# EAGLE schematic 50_Shot_Relay_V0.0 (EAGLE 7.6.0)
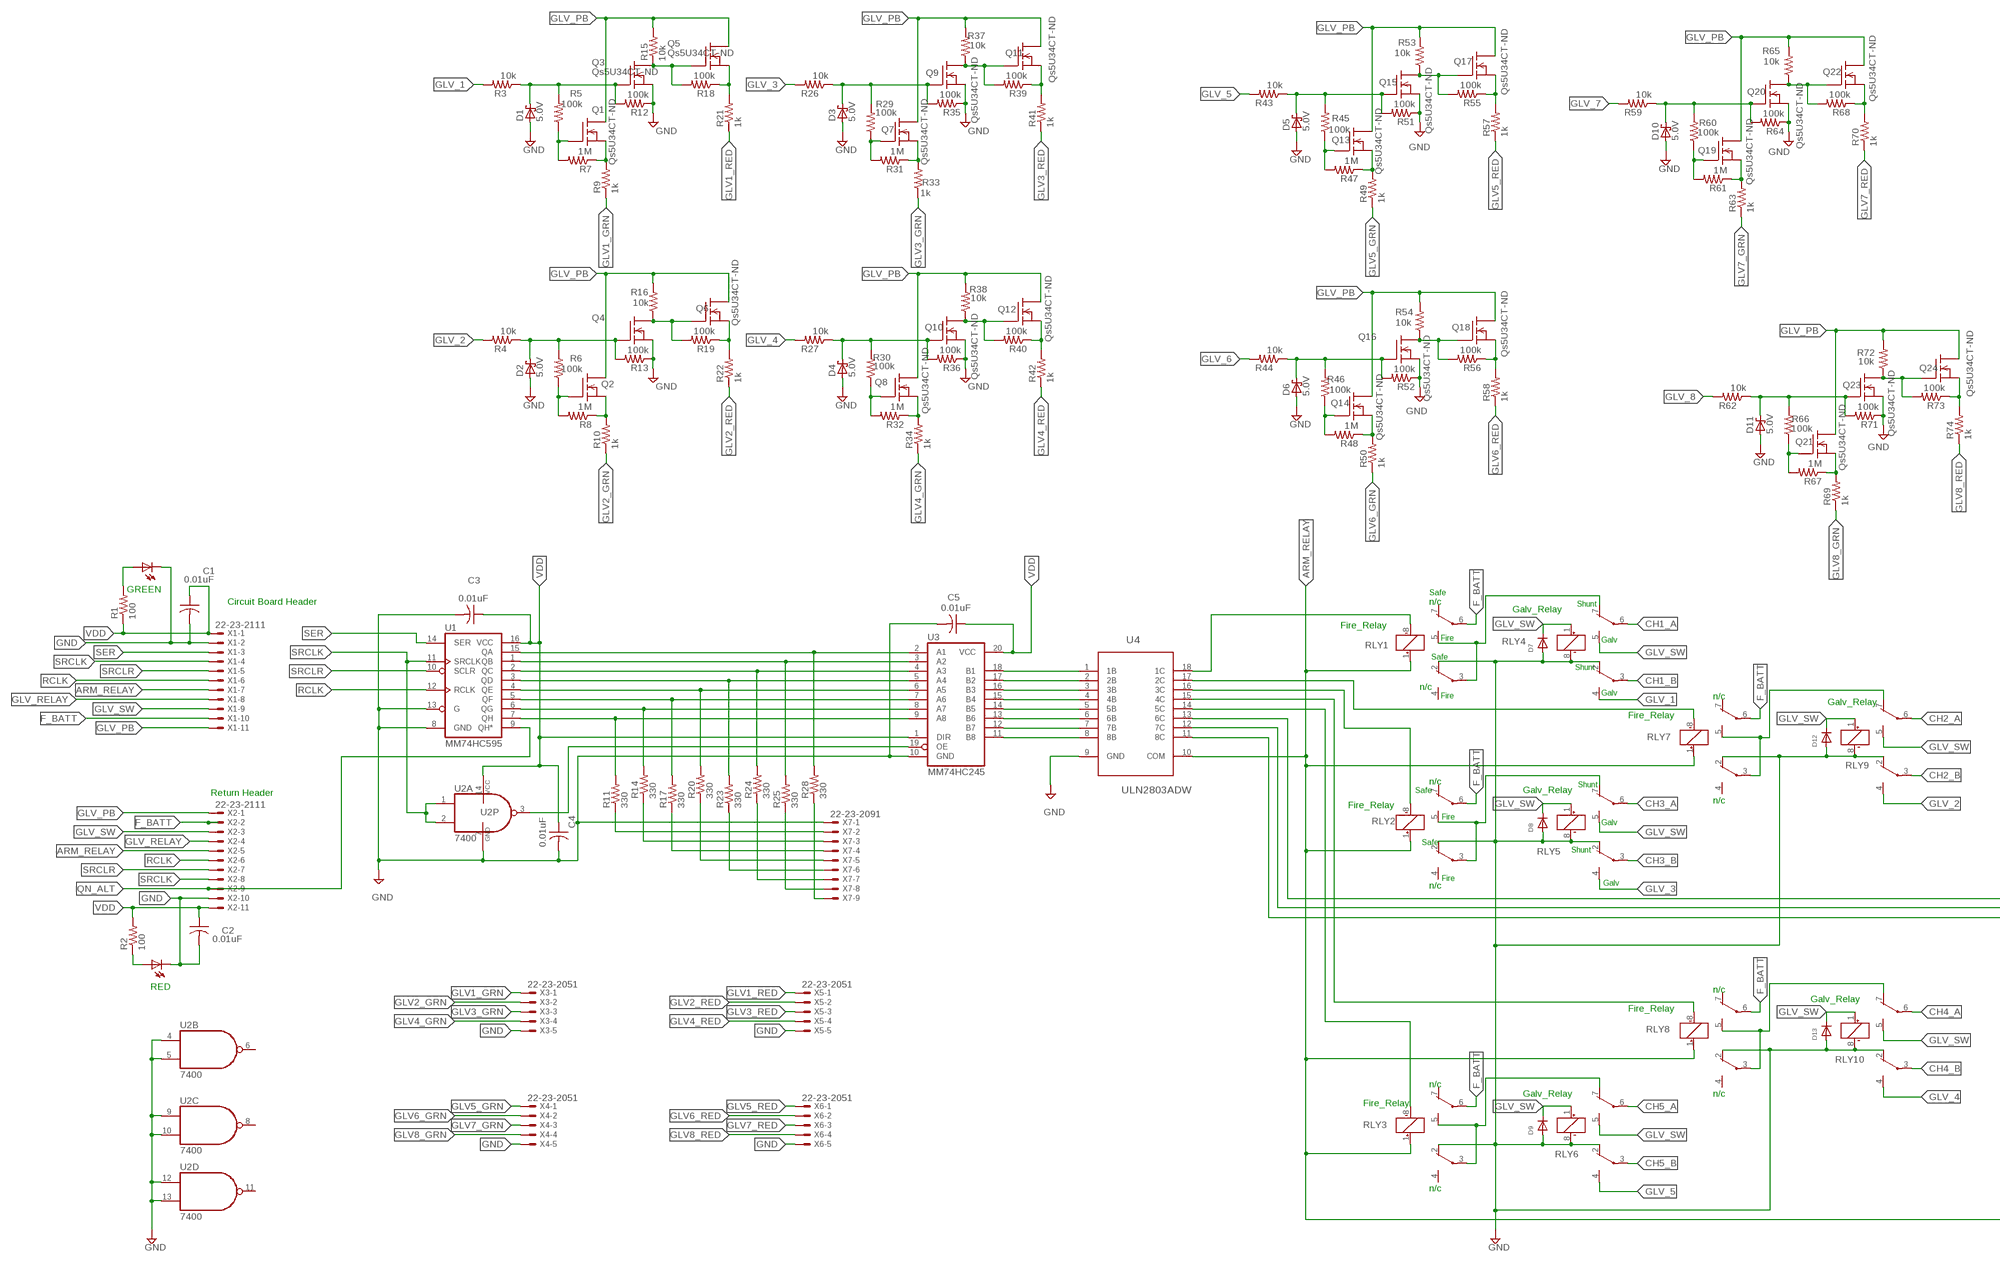
[diagram p0: schematic, sheet 1, part 1 of 2]
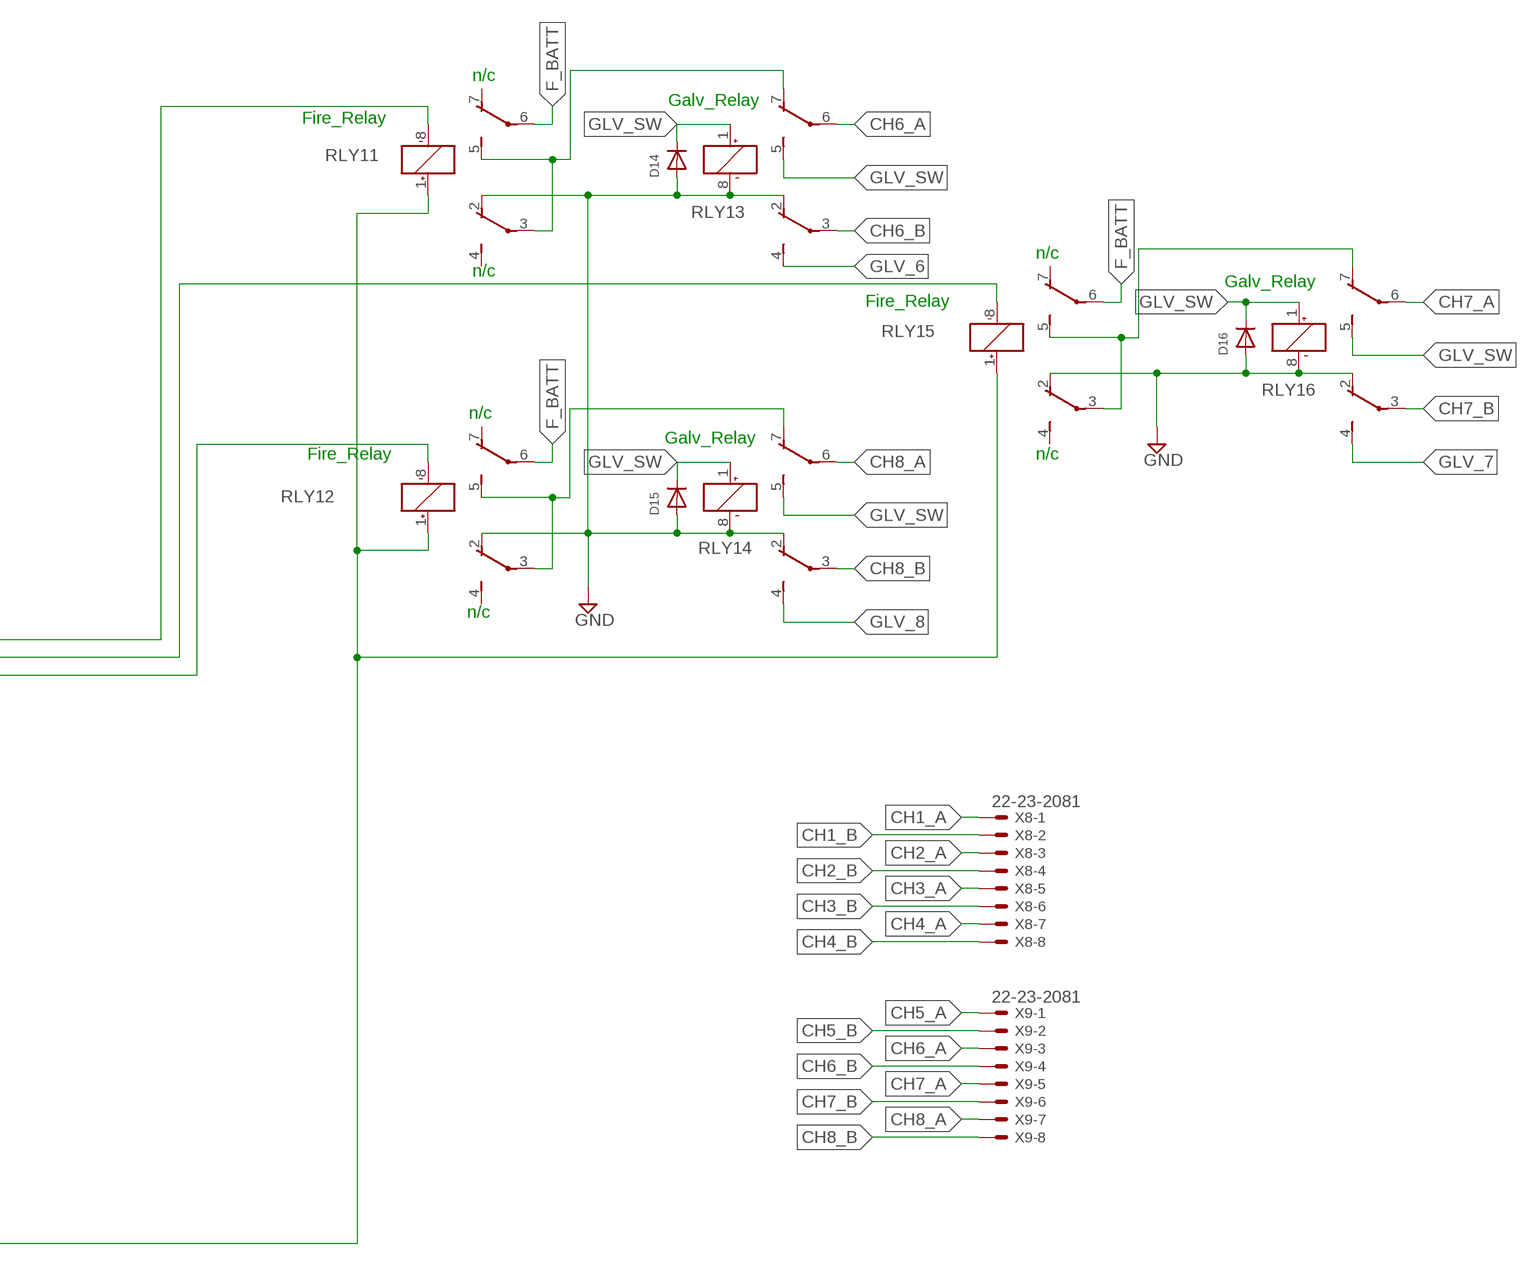
[diagram p1: schematic, sheet 1, part 2 of 2]

## Parts
C1  0.01uF  C-USC0805  [C0805]
C2  0.01uF  C-USC0805  [C0805]
C3  0.01uF  C-USC0805  [C0805]
C4  0.01uF  C-USC0805  [C0805]
C5  0.01uF  C-USC0805  [C0805]
D1  5.0V  568-6471-1-ND_ZENER_5.0V  [SOT23]
D2  5.0V  568-6471-1-ND_ZENER_5.0V  [SOT23]
D3  5.0V  568-6471-1-ND_ZENER_5.0V  [SOT23]
D4  5.0V  568-6471-1-ND_ZENER_5.0V  [SOT23]
D5  5.0V  568-6471-1-ND_ZENER_5.0V  [SOT23]
D6  5.0V  568-6471-1-ND_ZENER_5.0V  [SOT23]
D7  SA2M-E3/5ATGICT-ND  DIODE_SA2M-E3/5ATGICT-ND  [DO214AC]
D8  SA2M-E3/5ATGICT-ND  DIODE_SA2M-E3/5ATGICT-ND  [DO214AC]
D9  SA2M-E3/5ATGICT-ND  DIODE_SA2M-E3/5ATGICT-ND  [DO214AC]
D10  5.0V  568-6471-1-ND_ZENER_5.0V  [SOT23]
D11  5.0V  568-6471-1-ND_ZENER_5.0V  [SOT23]
D12  SA2M-E3/5ATGICT-ND  DIODE_SA2M-E3/5ATGICT-ND  [DO214AC]
D13  SA2M-E3/5ATGICT-ND  DIODE_SA2M-E3/5ATGICT-ND  [DO214AC]
D14  SA2M-E3/5ATGICT-ND  DIODE_SA2M-E3/5ATGICT-ND  [DO214AC]
D15  SA2M-E3/5ATGICT-ND  DIODE_SA2M-E3/5ATGICT-ND  [DO214AC]
D16  SA2M-E3/5ATGICT-ND  DIODE_SA2M-E3/5ATGICT-ND  [DO214AC]
LED1  LEDCHIP-LED0805  [CHIP-LED0805]
LED2  LEDCHIP-LED0805  [CHIP-LED0805]
Q1  Qs5U34CT-ND  QS5U34CT-ND_MOSFET_N_CHANNEL  [SOT23-5L]
Q2  Qs5U34CT-ND  QS5U34CT-ND_MOSFET_N_CHANNEL  [SOT23-5L]
Q3  Qs5U34CT-ND  QS5U34CT-ND_MOSFET_N_CHANNEL  [SOT23-5L]
Q4  Qs5U34CT-ND  QS5U34CT-ND_MOSFET_N_CHANNEL  [SOT23-5L]
Q5  Qs5U34CT-ND  QS5U34CT-ND_MOSFET_N_CHANNEL  [SOT23-5L]
Q6  Qs5U34CT-ND  QS5U34CT-ND_MOSFET_N_CHANNEL  [SOT23-5L]
Q7  Qs5U34CT-ND  QS5U34CT-ND_MOSFET_N_CHANNEL  [SOT23-5L]
Q8  Qs5U34CT-ND  QS5U34CT-ND_MOSFET_N_CHANNEL  [SOT23-5L]
Q9  Qs5U34CT-ND  QS5U34CT-ND_MOSFET_N_CHANNEL  [SOT23-5L]
Q10  Qs5U34CT-ND  QS5U34CT-ND_MOSFET_N_CHANNEL  [SOT23-5L]
Q11  Qs5U34CT-ND  QS5U34CT-ND_MOSFET_N_CHANNEL  [SOT23-5L]
Q12  Qs5U34CT-ND  QS5U34CT-ND_MOSFET_N_CHANNEL  [SOT23-5L]
Q13  Qs5U34CT-ND  QS5U34CT-ND_MOSFET_N_CHANNEL  [SOT23-5L]
Q14  Qs5U34CT-ND  QS5U34CT-ND_MOSFET_N_CHANNEL  [SOT23-5L]
Q15  Qs5U34CT-ND  QS5U34CT-ND_MOSFET_N_CHANNEL  [SOT23-5L]
Q16  Qs5U34CT-ND  QS5U34CT-ND_MOSFET_N_CHANNEL  [SOT23-5L]
Q17  Qs5U34CT-ND  QS5U34CT-ND_MOSFET_N_CHANNEL  [SOT23-5L]
Q18  Qs5U34CT-ND  QS5U34CT-ND_MOSFET_N_CHANNEL  [SOT23-5L]
Q19  Qs5U34CT-ND  QS5U34CT-ND_MOSFET_N_CHANNEL  [SOT23-5L]
Q20  Qs5U34CT-ND  QS5U34CT-ND_MOSFET_N_CHANNEL  [SOT23-5L]
Q21  Qs5U34CT-ND  QS5U34CT-ND_MOSFET_N_CHANNEL  [SOT23-5L]
Q22  Qs5U34CT-ND  QS5U34CT-ND_MOSFET_N_CHANNEL  [SOT23-5L]
Q23  Qs5U34CT-ND  QS5U34CT-ND_MOSFET_N_CHANNEL  [SOT23-5L]
Q24  Qs5U34CT-ND  QS5U34CT-ND_MOSFET_N_CHANNEL  [SOT23-5L]
R1  100  R-US_M0805  [M0805]
R2  100  R-US_M0805  [M0805]
R3  10k  R-US_M0805  [M0805]
R4  10k  R-US_M0805  [M0805]
R5  100k  R-US_M0805  [M0805]
R6  100k  R-US_M0805  [M0805]
R7  1M  R-US_M0805  [M0805]
R8  1M  R-US_M0805  [M0805]
R9  1k  R-US_M0805  [M0805]
R10  1k  R-US_M0805  [M0805]
R11  330  R-US_M0805  [M0805]
R12  100k  R-US_M0805  [M0805]
R13  100k  R-US_M0805  [M0805]
R14  330  R-US_M0805  [M0805]
R15  10k  R-US_M0805  [M0805]
R16  10k  R-US_M0805  [M0805]
R17  330  R-US_M0805  [M0805]
R18  100k  R-US_M0805  [M0805]
R19  100k  R-US_M0805  [M0805]
R20  330  R-US_M0805  [M0805]
R21  1k  R-US_M0805  [M0805]
R22  1k  R-US_M0805  [M0805]
R23  330  R-US_M0805  [M0805]
R24  330  R-US_M0805  [M0805]
R25  330  R-US_M0805  [M0805]
R26  10k  R-US_M0805  [M0805]
R27  10k  R-US_M0805  [M0805]
R28  330  R-US_M0805  [M0805]
R29  100k  R-US_M0805  [M0805]
R30  100k  R-US_M0805  [M0805]
R31  1M  R-US_M0805  [M0805]
R32  1M  R-US_M0805  [M0805]
R33  1k  R-US_M0805  [M0805]
R34  1k  R-US_M0805  [M0805]
R35  100k  R-US_M0805  [M0805]
R36  100k  R-US_M0805  [M0805]
R37  10k  R-US_M0805  [M0805]
R38  10k  R-US_M0805  [M0805]
R39  100k  R-US_M0805  [M0805]
R40  100k  R-US_M0805  [M0805]
R41  1k  R-US_M0805  [M0805]
R42  1k  R-US_M0805  [M0805]
R43  10k  R-US_M0805  [M0805]
R44  10k  R-US_M0805  [M0805]
R45  100k  R-US_M0805  [M0805]
R46  100k  R-US_M0805  [M0805]
R47  1M  R-US_M0805  [M0805]
R48  1M  R-US_M0805  [M0805]
R49  1k  R-US_M0805  [M0805]
R50  1k  R-US_M0805  [M0805]
R51  100k  R-US_M0805  [M0805]
R52  100k  R-US_M0805  [M0805]
R53  10k  R-US_M0805  [M0805]
R54  10k  R-US_M0805  [M0805]
R55  100k  R-US_M0805  [M0805]
R56  100k  R-US_M0805  [M0805]
R57  1k  R-US_M0805  [M0805]
R58  1k  R-US_M0805  [M0805]
R59  10k  R-US_M0805  [M0805]
R60  100k  R-US_M0805  [M0805]
R61  1M  R-US_M0805  [M0805]
R62  10k  R-US_M0805  [M0805]
R63  1k  R-US_M0805  [M0805]
R64  100k  R-US_M0805  [M0805]
R65  10k  R-US_M0805  [M0805]
R66  100k  R-US_M0805  [M0805]
R67  1M  R-US_M0805  [M0805]
R68  100k  R-US_M0805  [M0805]
R69  1k  R-US_M0805  [M0805]
R70  1k  R-US_M0805  [M0805]
R71  100k  R-US_M0805  [M0805]
R72  10k  R-US_M0805  [M0805]
R73  100k  R-US_M0805  [M0805]
R74  1k  R-US_M0805  [M0805]
RLY1  OMRON  [OMRONG6S]
RLY2  OMRON  [OMRONG6S]
RLY3  OMRON  [OMRONG6S]
RLY4  OMRON  [OMRONG6S]
RLY5  OMRON  [OMRONG6S]
RLY6  OMRON  [OMRONG6S]
RLY7  OMRON  [OMRONG6S]
RLY8  OMRON  [OMRONG6S]
RLY9  OMRON  [OMRONG6S]
RLY10  OMRON  [OMRONG6S]
RLY11  OMRON  [OMRONG6S]
RLY12  OMRON  [OMRONG6S]
RLY13  OMRON  [OMRONG6S]
RLY14  OMRON  [OMRONG6S]
RLY15  OMRON  [OMRONG6S]
RLY16  OMRON  [OMRONG6S]
U1  MM74HC595  [TSSOP16]
U2  7400  [TSSOP14]
U3  MM74HC245  [TSSOP20]
U4  ULN2803ADW  [SOIC127P1030X265-18N]
X1  22-23-2111  [22-23-2111]
X2  22-23-2111  [22-23-2111]
X3  22-23-2051  [22-23-2051]
X4  22-23-2051  [22-23-2051]
X5  22-23-2051  [22-23-2051]
X6  22-23-2051  [22-23-2051]
X7  22-23-2091  [22-23-2091]
X8  22-23-2081  [22-23-2081]
X9  22-23-2081  [22-23-2081]

## Nets
ARM_RELAY: RLY1.1(1:+) RLY2.1(1:+) RLY3.1(1:+) RLY7.1(1:+) RLY8.1(1:+) RLY11.1(1:+) RLY12.1(1:+) RLY15.1(1:+) U4.10(COM) X1.7 X2.5
CH1_A: RLY4.6(2:P) X8.1
CH1_B: RLY4.3(3:P) X8.2
CH2_A: RLY9.6(2:P) X8.3
CH2_B: RLY9.3(3:P) X8.4
CH3_A: RLY5.6(2:P) X8.5
CH3_B: RLY5.3(3:P) X8.6
CH4_A: RLY10.6(2:P) X8.7
CH4_B: RLY10.3(3:P) X8.8
CH5_A: RLY6.6(2:P) X9.1
CH5_B: RLY6.3(3:P) X9.2
CH6_A: RLY13.6(2:P) X9.3
CH6_B: RLY13.3(3:P) X9.4
CH7_A: RLY16.6(2:P) X9.5
CH7_B: RLY16.3(3:P) X9.6
CH8_A: RLY14.6(2:P) X9.7
CH8_B: RLY14.3(3:P) X9.8
F_BATT: RLY1.6(2:P) RLY2.6(2:P) RLY3.6(2:P) RLY7.6(2:P) RLY8.6(2:P) RLY11.6(2:P) RLY12.6(2:P) RLY15.6(2:P) X1.10 X2.2
GLV1_GRN: R9.1 X3.1
GLV1_RED: R21.1 X5.1
GLV2_GRN: R10.1 X3.2
GLV2_RED: R22.1 X5.2
GLV3_GRN: R33.1 X3.3
GLV3_RED: R41.1 X5.3
GLV4_GRN: R34.1 X3.4
GLV4_RED: R42.1 X5.4
GLV5_GRN: R49.1 X4.1
GLV5_RED: R57.1 X6.1
GLV6_GRN: R50.1 X4.2
GLV6_RED: R58.1 X6.2
GLV7_GRN: R63.1 X4.3
GLV7_RED: R70.1 X6.3
GLV8_GRN: R69.1 X4.4
GLV8_RED: R74.1 X6.4
GLV_1: R3.2 RLY4.4(3:S)
GLV_2: R4.2 RLY9.4(3:S)
GLV_3: R26.2 RLY5.4(3:S)
GLV_4: R27.2 RLY10.4(3:S)
GLV_5: R43.2 RLY6.4(3:S)
GLV_6: R44.2 RLY13.4(3:S)
GLV_7: R59.2 RLY16.4(3:S)
GLV_8: R62.2 RLY14.4(3:S)
GLV_PB: Q1.5(D) Q2.5(D) Q5.5(D) Q6.5(D) Q7.5(D) Q8.5(D) Q11.5(D) Q12.5(D) Q13.5(D) Q14.5(D) Q17.5(D) Q18.5(D) Q19.5(D) Q21.5(D) Q22.5(D) Q24.5(D) R15.2 R16.2 R37.2 R38.2 R53.2 R54.2 R65.2 R72.2 X1.11 X2.1
GLV_RELAY: X1.8 X2.4
GLV_SW: D7.C D8.C D9.C D12.C D13.C D14.C D15.C D16.C RLY4.1(1:+) RLY4.5(2:S) RLY5.1(1:+) RLY5.5(2:S) RLY6.1(1:+) RLY6.5(2:S) RLY9.1(1:+) RLY9.5(2:S) RLY10.1(1:+) RLY10.5(2:S) RLY13.1(1:+) RLY13.5(2:S) RLY14.1(1:+) RLY14.5(2:S) RLY16.1(1:+) RLY16.5(2:S) X1.9 X2.3
GND: C1.2 C2.2 C3.2 C4.2 C5.2 D1.1(A) D2.1(A) D3.1(A) D4.1(A) D5.1(A) D6.1(A) D7.A D8.A D9.A D10.1(A) D11.1(A) D12.A D13.A D14.A D15.A D16.A LED1.C LED2.C Q3.2(S) Q4.2(S) Q9.2(S) Q10.2(S) Q15.2(S) Q16.2(S) Q20.2(S) Q23.2(S) R12.1 R13.1 R35.1 R36.1 R51.1 R52.1 R64.1 R71.1 RLY1.2(3:O) RLY2.2(3:O) RLY3.2(3:O) RLY4.2(3:O) RLY4.8(1:-) RLY5.2(3:O) RLY5.8(1:-) RLY6.2(3:O) RLY6.8(1:-) RLY7.2(3:O) RLY8.2(3:O) RLY9.2(3:O) RLY9.8(1:-) RLY10.2(3:O) RLY10.8(1:-) RLY11.2(3:O) RLY12.2(3:O) RLY13.2(3:O) RLY13.8(1:-) RLY14.2(3:O) RLY14.8(1:-) RLY15.2(3:O) RLY16.2(3:O) RLY16.8(1:-) U1.8(GND) U1.13(G) U2.4(B:I0) U2.5(B:I1) U2.7(P:GND) U2.9(C:I0) U2.10(C:I1) U2.12(D:I0) U2.13(D:I1) U3.10(GND) U4.9(GND) X1.2 X2.10 X3.5 X4.5 X5.5 X6.5 X7.1
N$1: LED2.A R2.1
N$2: R17.1 X7.4
N$3: R14.1 X7.3
N$4: LED1.A R1.2
N$5: R11.1 X7.2
N$6: RLY1.3(3:P) RLY1.5(2:S) RLY4.7(2:O)
N$9: R28.2 U1.15(QA) U3.2(A1)
N$10: R25.2 U1.1(QB) U3.3(A2)
N$11: R24.2 U1.2(QC) U3.4(A3)
N$12: R23.2 U1.3(QD) U3.5(A4)
N$13: R20.2 U1.4(QE) U3.6(A5)
N$14: R17.2 U1.5(QF) U3.7(A6)
N$15: R14.2 U1.6(QG) U3.8(A7)
N$16: R11.2 U1.7(QH) U3.9(A8)
N$17: U3.18(B1) U4.1(1B)
N$18: U2.3(A:O) U3.19(OE)
N$28: U3.17(B2) U4.2(2B)
N$29: U3.16(B3) U4.3(3B)
N$30: U3.15(B4) U4.4(4B)
N$31: U3.14(B5) U4.5(5B)
N$32: U3.13(B6) U4.6(6B)
N$33: U3.12(B7) U4.7(7B)
N$34: U3.11(B8) U4.8(8B)
N$43: RLY1.8(1:-) U4.18(1C)
N$45: RLY7.8(1:-) U4.17(2C)
N$46: RLY2.8(1:-) U4.16(3C)
N$47: RLY8.8(1:-) U4.15(4C)
N$48: RLY3.8(1:-) U4.14(5C)
N$49: RLY11.8(1:-) U4.13(6C)
N$50: RLY15.8(1:-) U4.12(7C)
N$51: RLY12.8(1:-) U4.11(8C)
N$63: RLY2.3(3:P) RLY2.5(2:S) RLY5.7(2:O)
N$68: RLY7.3(3:P) RLY7.5(2:S) RLY9.7(2:O)
N$71: RLY3.3(3:P) RLY3.5(2:S) RLY6.7(2:O)
N$75: RLY8.3(3:P) RLY8.5(2:S) RLY10.7(2:O)
N$80: RLY11.3(3:P) RLY11.5(2:S) RLY13.7(2:O)
N$87: RLY12.3(3:P) RLY12.5(2:S) RLY14.7(2:O)
N$94: RLY15.3(3:P) RLY15.5(2:S) RLY16.7(2:O)
N$106: D1.3(C) Q3.1(G) R3.1 R5.2 R12.2
N$107: Q1.1(G) R5.1 R7.2
N$108: Q5.2(S) R18.1 R21.2
N$109: Q1.2(S) R7.1 R9.2
N$110: Q3.5(D) Q5.1(G) R15.1 R18.2
N$114: D2.3(C) Q4.1(G) R4.1 R6.2 R13.2
N$115: Q2.1(G) R6.1 R8.2
N$116: Q2.2(S) R8.1 R10.2
N$117: Q4.5(D) Q6.1(G) R16.1 R19.2
N$118: Q6.2(S) R19.1 R22.2
N$120: D3.3(C) Q9.1(G) R26.1 R29.2 R35.2
N$121: Q7.1(G) R29.1 R31.2
N$122: Q7.2(S) R31.1 R33.2
N$123: Q9.5(D) Q11.1(G) R37.1 R39.2
N$124: Q11.2(S) R39.1 R41.2
N$127: D4.3(C) Q10.1(G) R27.1 R30.2 R36.2
N$128: Q8.1(G) R30.1 R32.2
N$129: Q8.2(S) R32.1 R34.2
N$130: Q10.5(D) Q12.1(G) R38.1 R40.2
N$131: Q12.2(S) R40.1 R42.2
N$134: D10.3(C) Q20.1(G) R59.1 R60.2 R64.2
N$135: Q19.1(G) R60.1 R61.2
N$136: Q19.2(S) R61.1 R63.2
N$137: Q20.5(D) Q22.1(G) R65.1 R68.2
N$138: Q22.2(S) R68.1 R70.2
N$141: D6.3(C) Q16.1(G) R44.1 R46.2 R52.2
N$142: Q14.1(G) R46.1 R48.2
N$143: Q14.2(S) R48.1 R50.2
N$144: Q16.5(D) Q18.1(G) R54.1 R56.2
N$145: Q18.2(S) R56.1 R58.2
N$148: D5.3(C) Q15.1(G) R43.1 R45.2 R51.2
N$149: Q13.1(G) R45.1 R47.2
N$150: Q13.2(S) R47.1 R49.2
N$151: Q15.5(D) Q17.1(G) R53.1 R55.2
N$152: Q17.2(S) R55.1 R57.2
N$155: D11.3(C) Q23.1(G) R62.1 R66.2 R71.2
N$156: Q21.1(G) R66.1 R67.2
N$157: Q21.2(S) R67.1 R69.2
N$158: Q23.5(D) Q24.1(G) R72.1 R73.2
N$159: Q24.2(S) R73.1 R74.2
N$174: R28.1 X7.9
N$175: R25.1 X7.8
N$176: R24.1 X7.7
N$177: R23.1 X7.6
N$178: R20.1 X7.5
QN_ALT: U1.9(QH*) X2.9
RCLK: U1.12(RCLK) X1.6 X2.6
SER: U1.14(SER) X1.3
SRCLK: U1.11(SRCLK) U2.1(A:I0) U2.2(A:I1) X1.4 X2.8
SRCLR: U1.10(SCLR) X1.5 X2.7
VDD: C1.1 C2.1 C3.1 C4.1 C5.1 R1.1 R2.2 U1.16(VCC) U2.14(P:VCC) U3.1(DIR) U3.20(VCC) X1.1 X2.11
Unconnected: RLY1.4(3:S) RLY1.7(2:O) RLY2.4(3:S) RLY2.7(2:O) RLY3.4(3:S) RLY3.7(2:O) RLY7.4(3:S) RLY7.7(2:O) RLY8.4(3:S) RLY8.7(2:O) RLY11.4(3:S) RLY11.7(2:O) RLY12.4(3:S) RLY12.7(2:O) RLY15.4(3:S) RLY15.7(2:O) U2.6(B:O) U2.8(C:O) U2.11(D:O)

## Notes on the sheet
- GREEN
- Safe
- n/c
- Circuit Board Header | n/c | Shunt
- Galv_Relay | Galv_Relay
- Fire_Relay
- Fire_Relay
- Fire | Galv
- Safe
- Shunt
- n/c
- Galv | n/c
- Fire | n/c
- Galv_Relay | n/c
- Galv_Relay
- Fire_Relay
- Fire_Relay
- n/c
- n/c
- Shunt
- Safe | Galv_Relay | Galv_Relay
- Return Header
- n/c | Fire_Relay | n/c
- Fire_Relay
- Fire
- Galv
- Safe
- Shunt
- Fire
- Galv | n/c
- n/c
- RED
- n/c
- Galv_Relay
- Fire_Relay
- n/c
- Galv_Relay | n/c
- Fire_Relay
- n/c

## Library data of the parts
C1 C2 = rcl:C-US: CAPACITOR, American symbol; MPN: VY2103M63Y5US63V7; OC_NEWARK: 69K4077
C3-C5 = rcl:C-US: CAPACITOR, American symbol; OC_NEWARK: unknown
D1-D6 D10 D11 = Mine:568-6471-1-ND_ZENER_5.0V; OC_NEWARK: unknown
D7-D9 D12-D16 = Mine:DIODE_SA2M-E3/5ATGICT-ND; OC_NEWARK: unknown
LED1 LED2 = Mine:LED: LED OSRAM: - CHIPLED LG R971, LG N971, LY N971, LG Q971, LY Q971, LO R971, LY R971 LH N974, LH R974 LS Q976, LO Q976, LY Q976 LO Q996 - Hyper CHIPLED LW Q18S LB Q993, LB Q99A, LB R99A - SideLED LS A670, LO A670, LY A670, LG A670, LP A670 LB A673, LV A673, LT A673, LW A673 LH A674 LY A675 LS A676, LA A676, LO A676, LY A676, LW A676 LS A679, LY A679, LG A679 - Hyper Micro SIDELED® LS Y876, LA Y876, LO Y876, LY Y876 LT Y87S - SmartLED LW L88C, LW L88S LB L89C, LB L89S, LG L890 LS L89K, LO L89K, LY L89K LS L896, LA L896, LO L896, LY L896 - TOPLED LS T670, LO T670, LY T670, LG T670, LP T670 LSG T670, LSP T670, LSY T670, LOP T670, LYG T670 LG T671, LOG T671, LSG T671 LB T673, LV T673, LT T673, LW T673 LH T674 LS T676, LA T676, LO T676, LY T676, LB T676, LH T676, LSB T676, LW T676 LB T67C, LV T67C, LT T67C, LS T67K, LO T67K, LY T67K, LW E67C LS E67B, LA E67B, LO E67B, LY E67B, LB E67C, LV E67C, LT E67C LW T67C LS T679, LY T679, LG T679 LS T770, LO T770, LY T770, LG T770, LP T770 LB T773, LV T773, LT T773, LW T773 LH T774 LS E675, LA E675, LY E675, LS T675 LS T776, LA T776, LO T776, LY T776, LB T776 LHGB T686 LT T68C, LB T68C - Hyper Mini TOPLED® LB M676 - Mini TOPLED Santana® LG M470 LS M47K, LO M47K, LY M47K Source: http://www.osram.convergy.de/; OC_NEWARK: unknown
Q1-Q24 = Mine:QS5U34CT-ND_MOSFET_N_CHANNEL: QS5U34CT-ND Enhancement mode, N-channel MOSFET Package: SOT 23-5; OC_NEWARK: unknown
R1-R74 = rcl:R-US_: RESISTOR, American symbol; OC_NEWARK: unknown
RLY1-RLY16 = Mine:OMRON: Low Signal Relay oeiwcsnts1.omron.com/.. D20G6K0100.pdf Package: Omron G6S-2F series; OC_NEWARK: unknown
U1 = Mine:MM74HC595; OC_NEWARK: unknown
U2 = 74xx-us:74*00: Quad 2-input NAND gate; OC_NEWARK: unknown
U3 = Mine:MM74HC245; OC_NEWARK: unknown
U4 = Texas Instruments_By_element14_Batch_1:ULN2803ADW: Darlington transistor array; MF: TEXAS INSTRUMENTS; MPN: ULN2803ADW; OC_FARNELL: 1652419; OC_NEWARK: 69K0711; PACKAGE: SOIC-18; SUPPLIER: TEXAS INSTRUMENTS
X1 X2 = con-molex:22-23-2111: .100" (2.54mm) Center Header - 11 Pin; OC_FARNELL: 5388879; OC_NEWARK: unknown
X3-X6 = Mine:22-23-2051: .100" (2.54mm) Center Header - 5 Pin; MF: MOLEX; MPN: 22-23-2051; OC_FARNELL: 1462952; OC_NEWARK: 38C9178
X7 = Mine:22-23-2091: .100" (2.54mm) Center Header - 9 Pin; MF: MOLEX; MPN: 22-23-2091; OC_FARNELL: 1756827; OC_NEWARK: 56H0450
X8 X9 = Mine:22-23-2081: .100" (2.54mm) Center Header - 8 Pin; MF: MOLEX; MPN: 22-23-2081; OC_FARNELL: 1756826; OC_NEWARK: 01C7592

## Net classes
0 default: width 0.254 mm, drill 0.508 mm, clearance 0.254 mm